# EasyEDA Pro project patched.epro, schematic Schematic1

## Sheets
1 sheet1_power_simplified: Board Name: Board1; Create Date: 2026-04-15; Page Name: sheet1_power_simplified; Project Name: Therapia_EEG-HRV; Schematic Name: Schematic1; Update Date: 2026-04-16; Company: EasyEDA.com; Page Size: A4; Version: V1.0
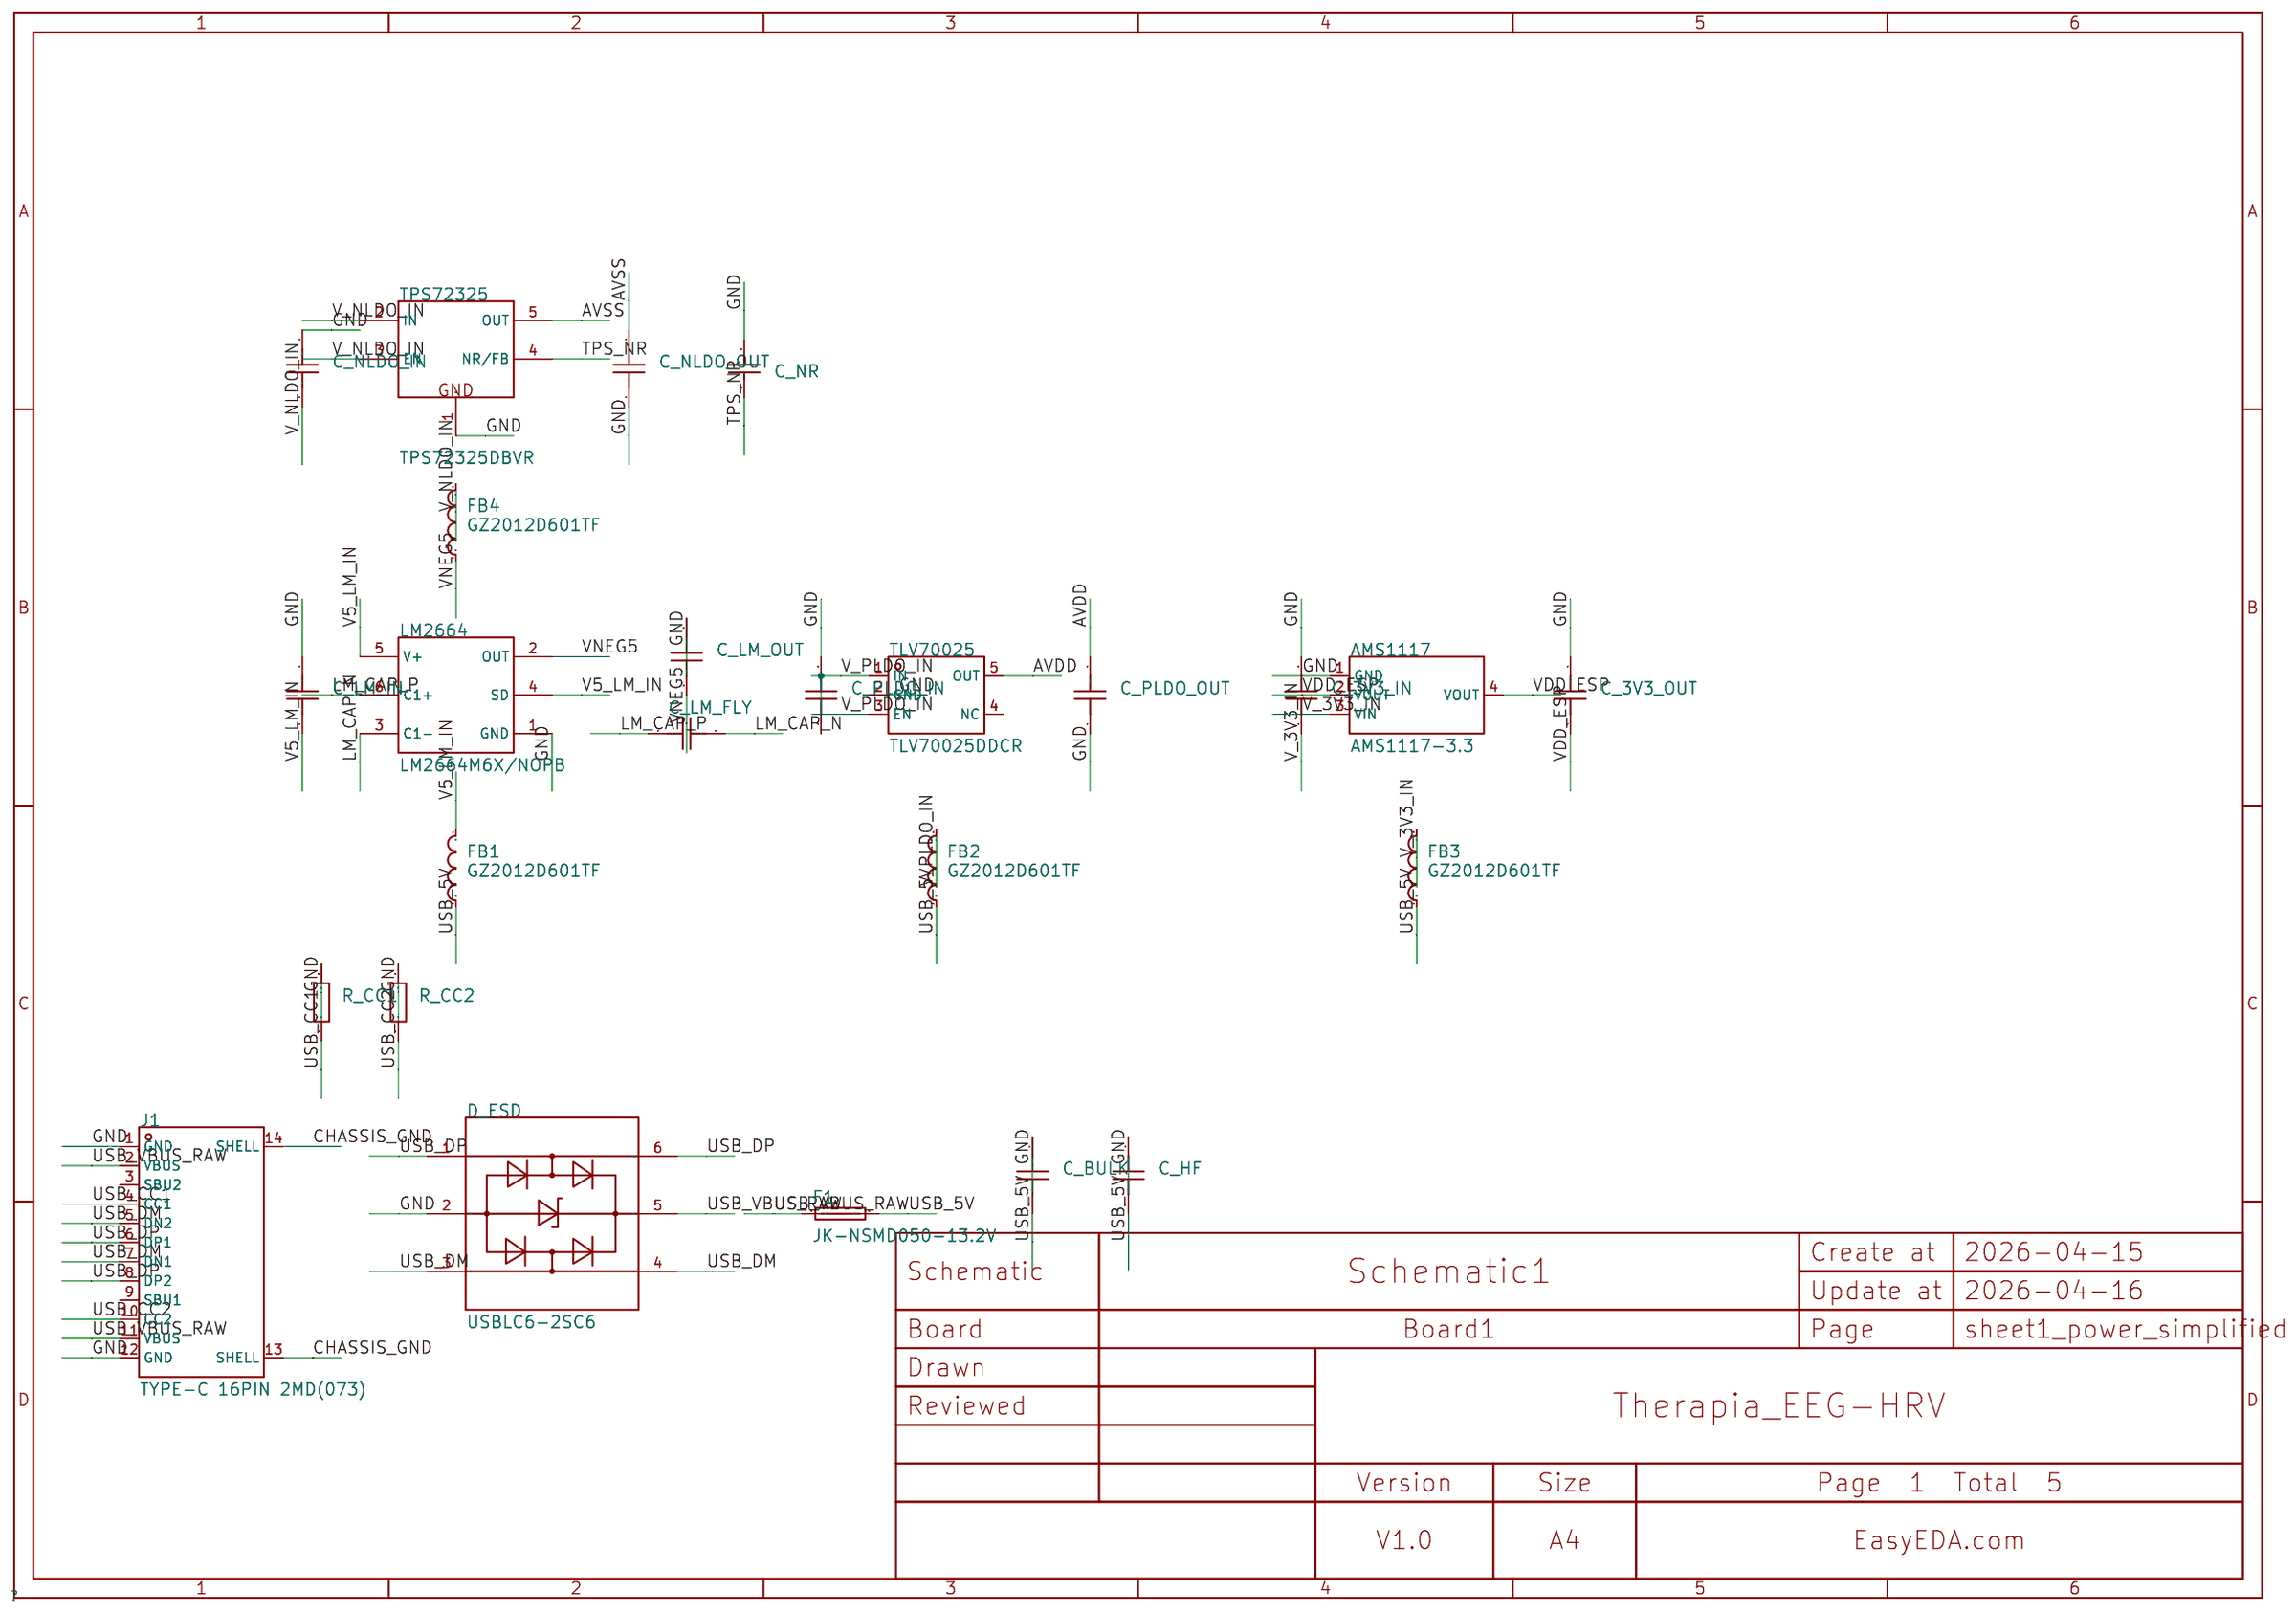
[diagram p0: sheet1_power_simplified]
2 sheet2_rails: Page Name: sheet2_rails
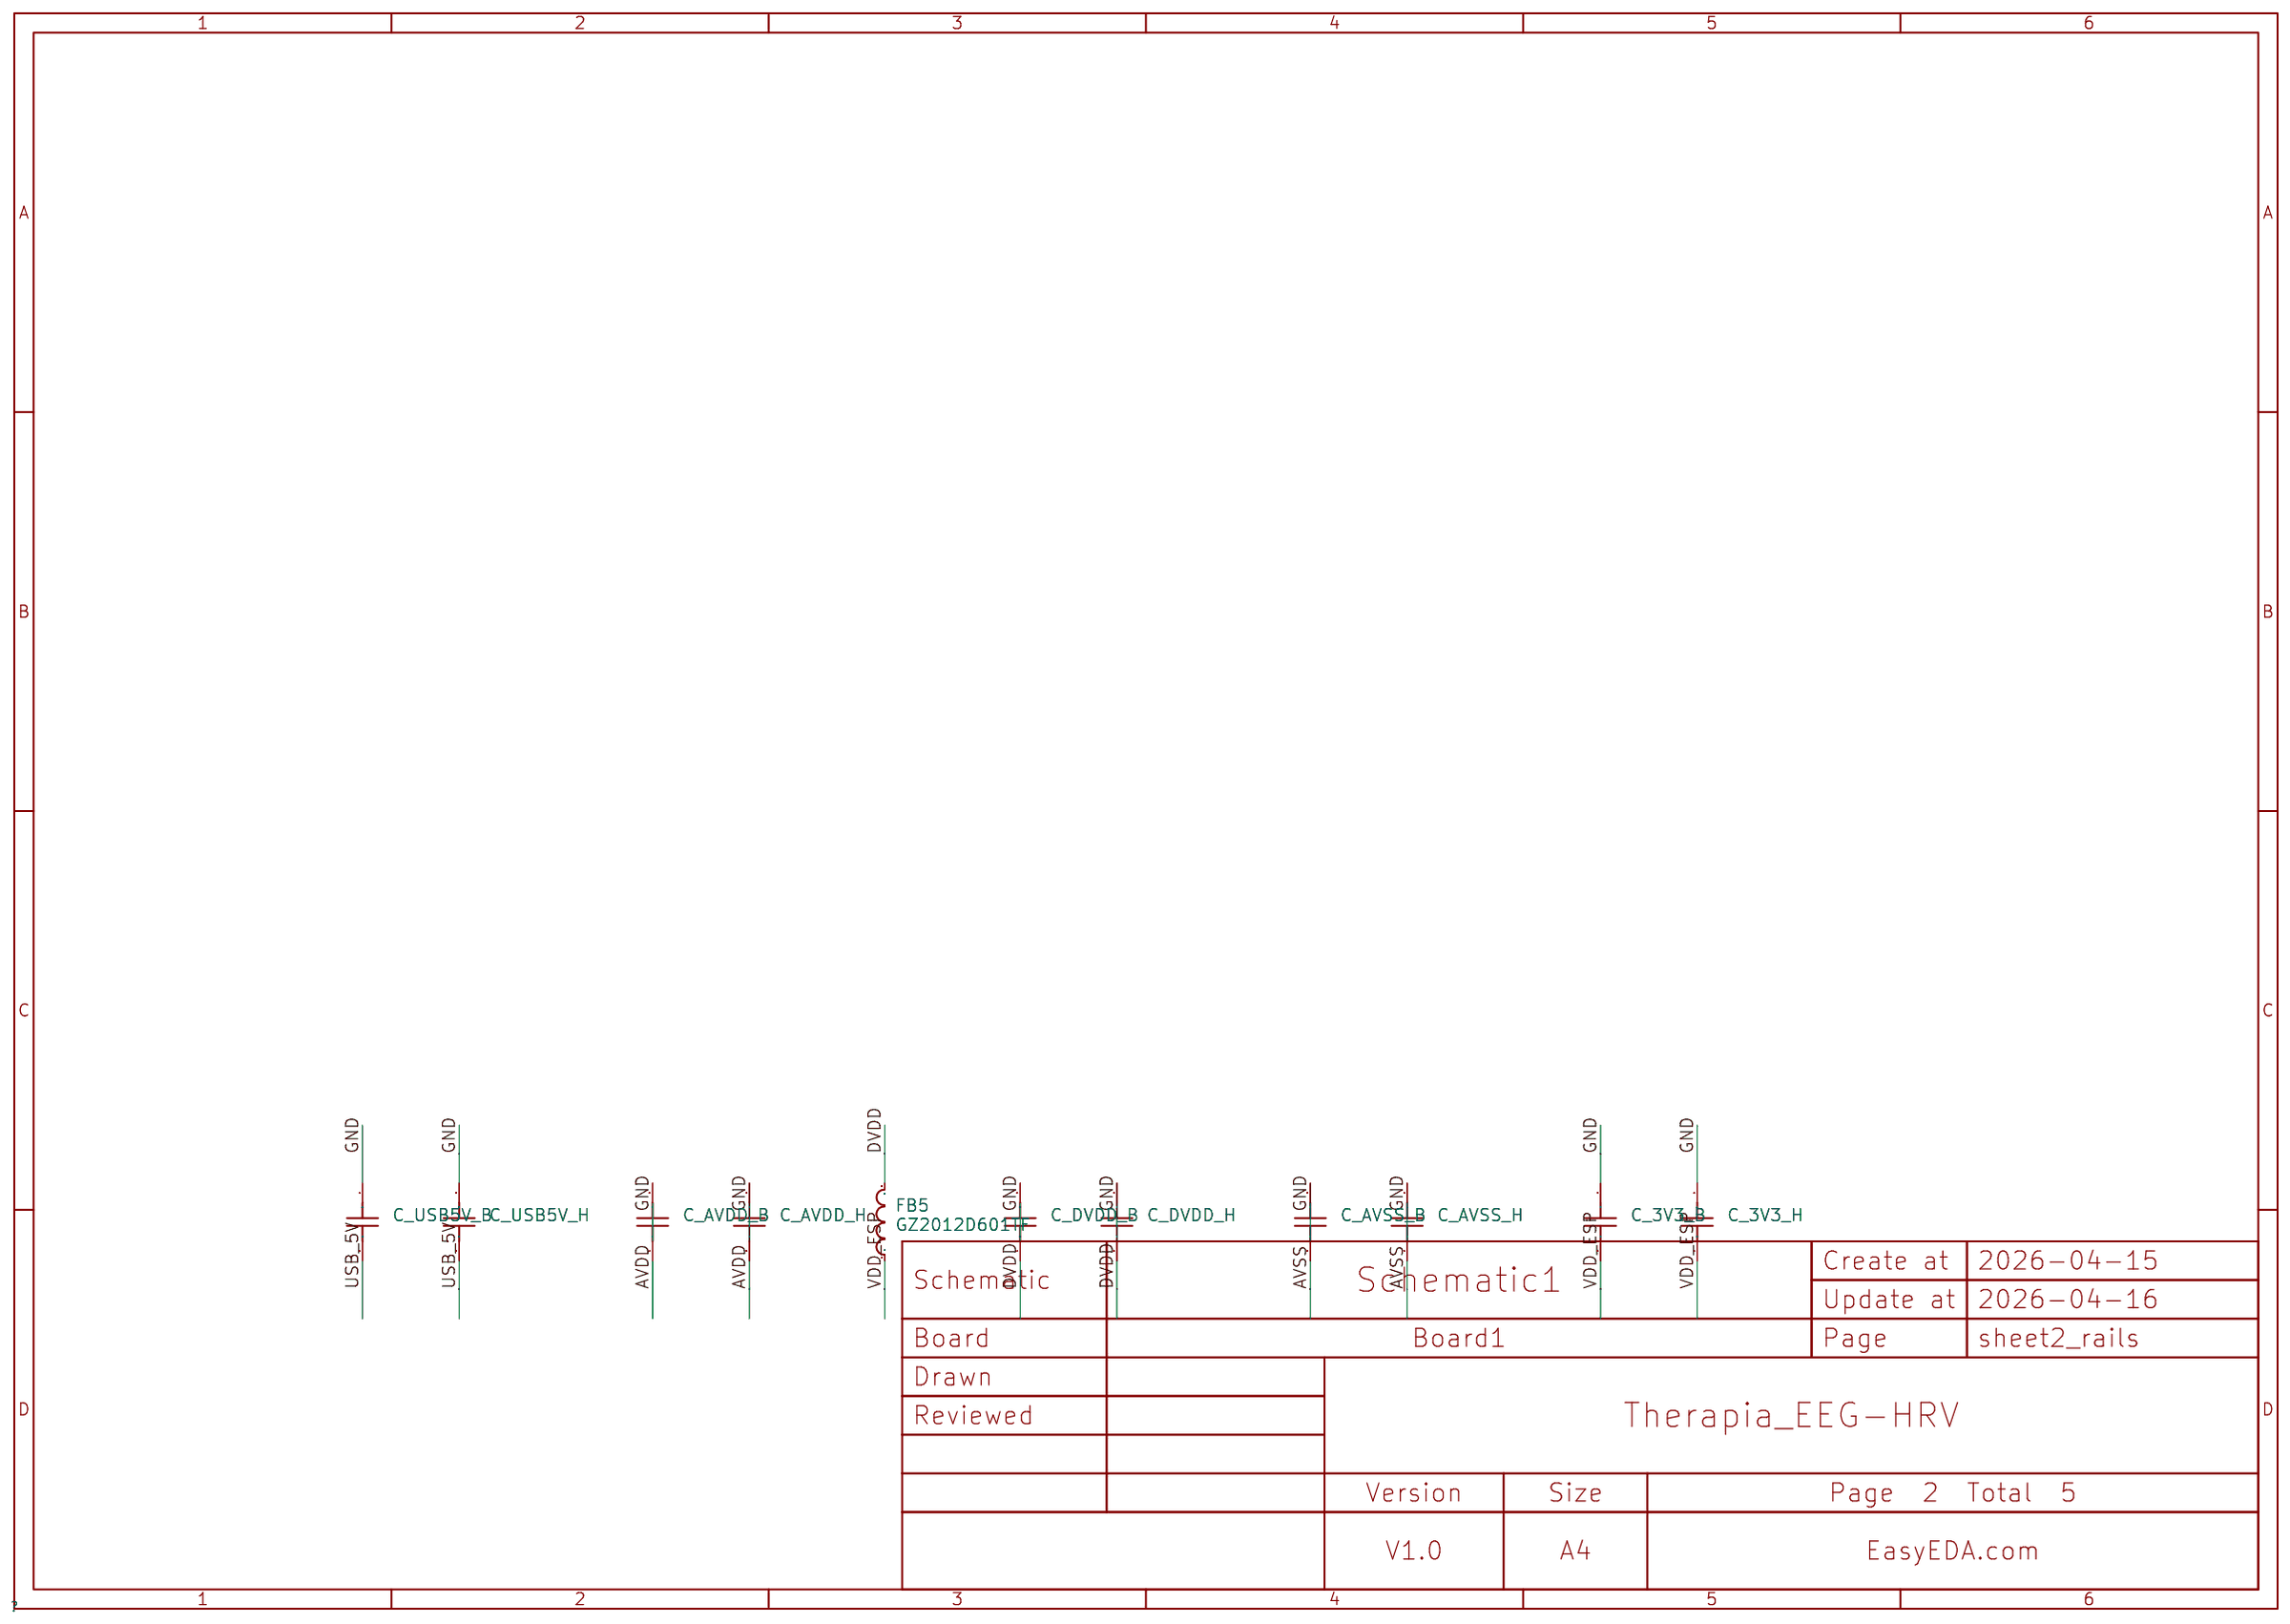
[diagram p1: sheet2_rails]
3 sheet3_mcu: Page Name: sheet3_mcu
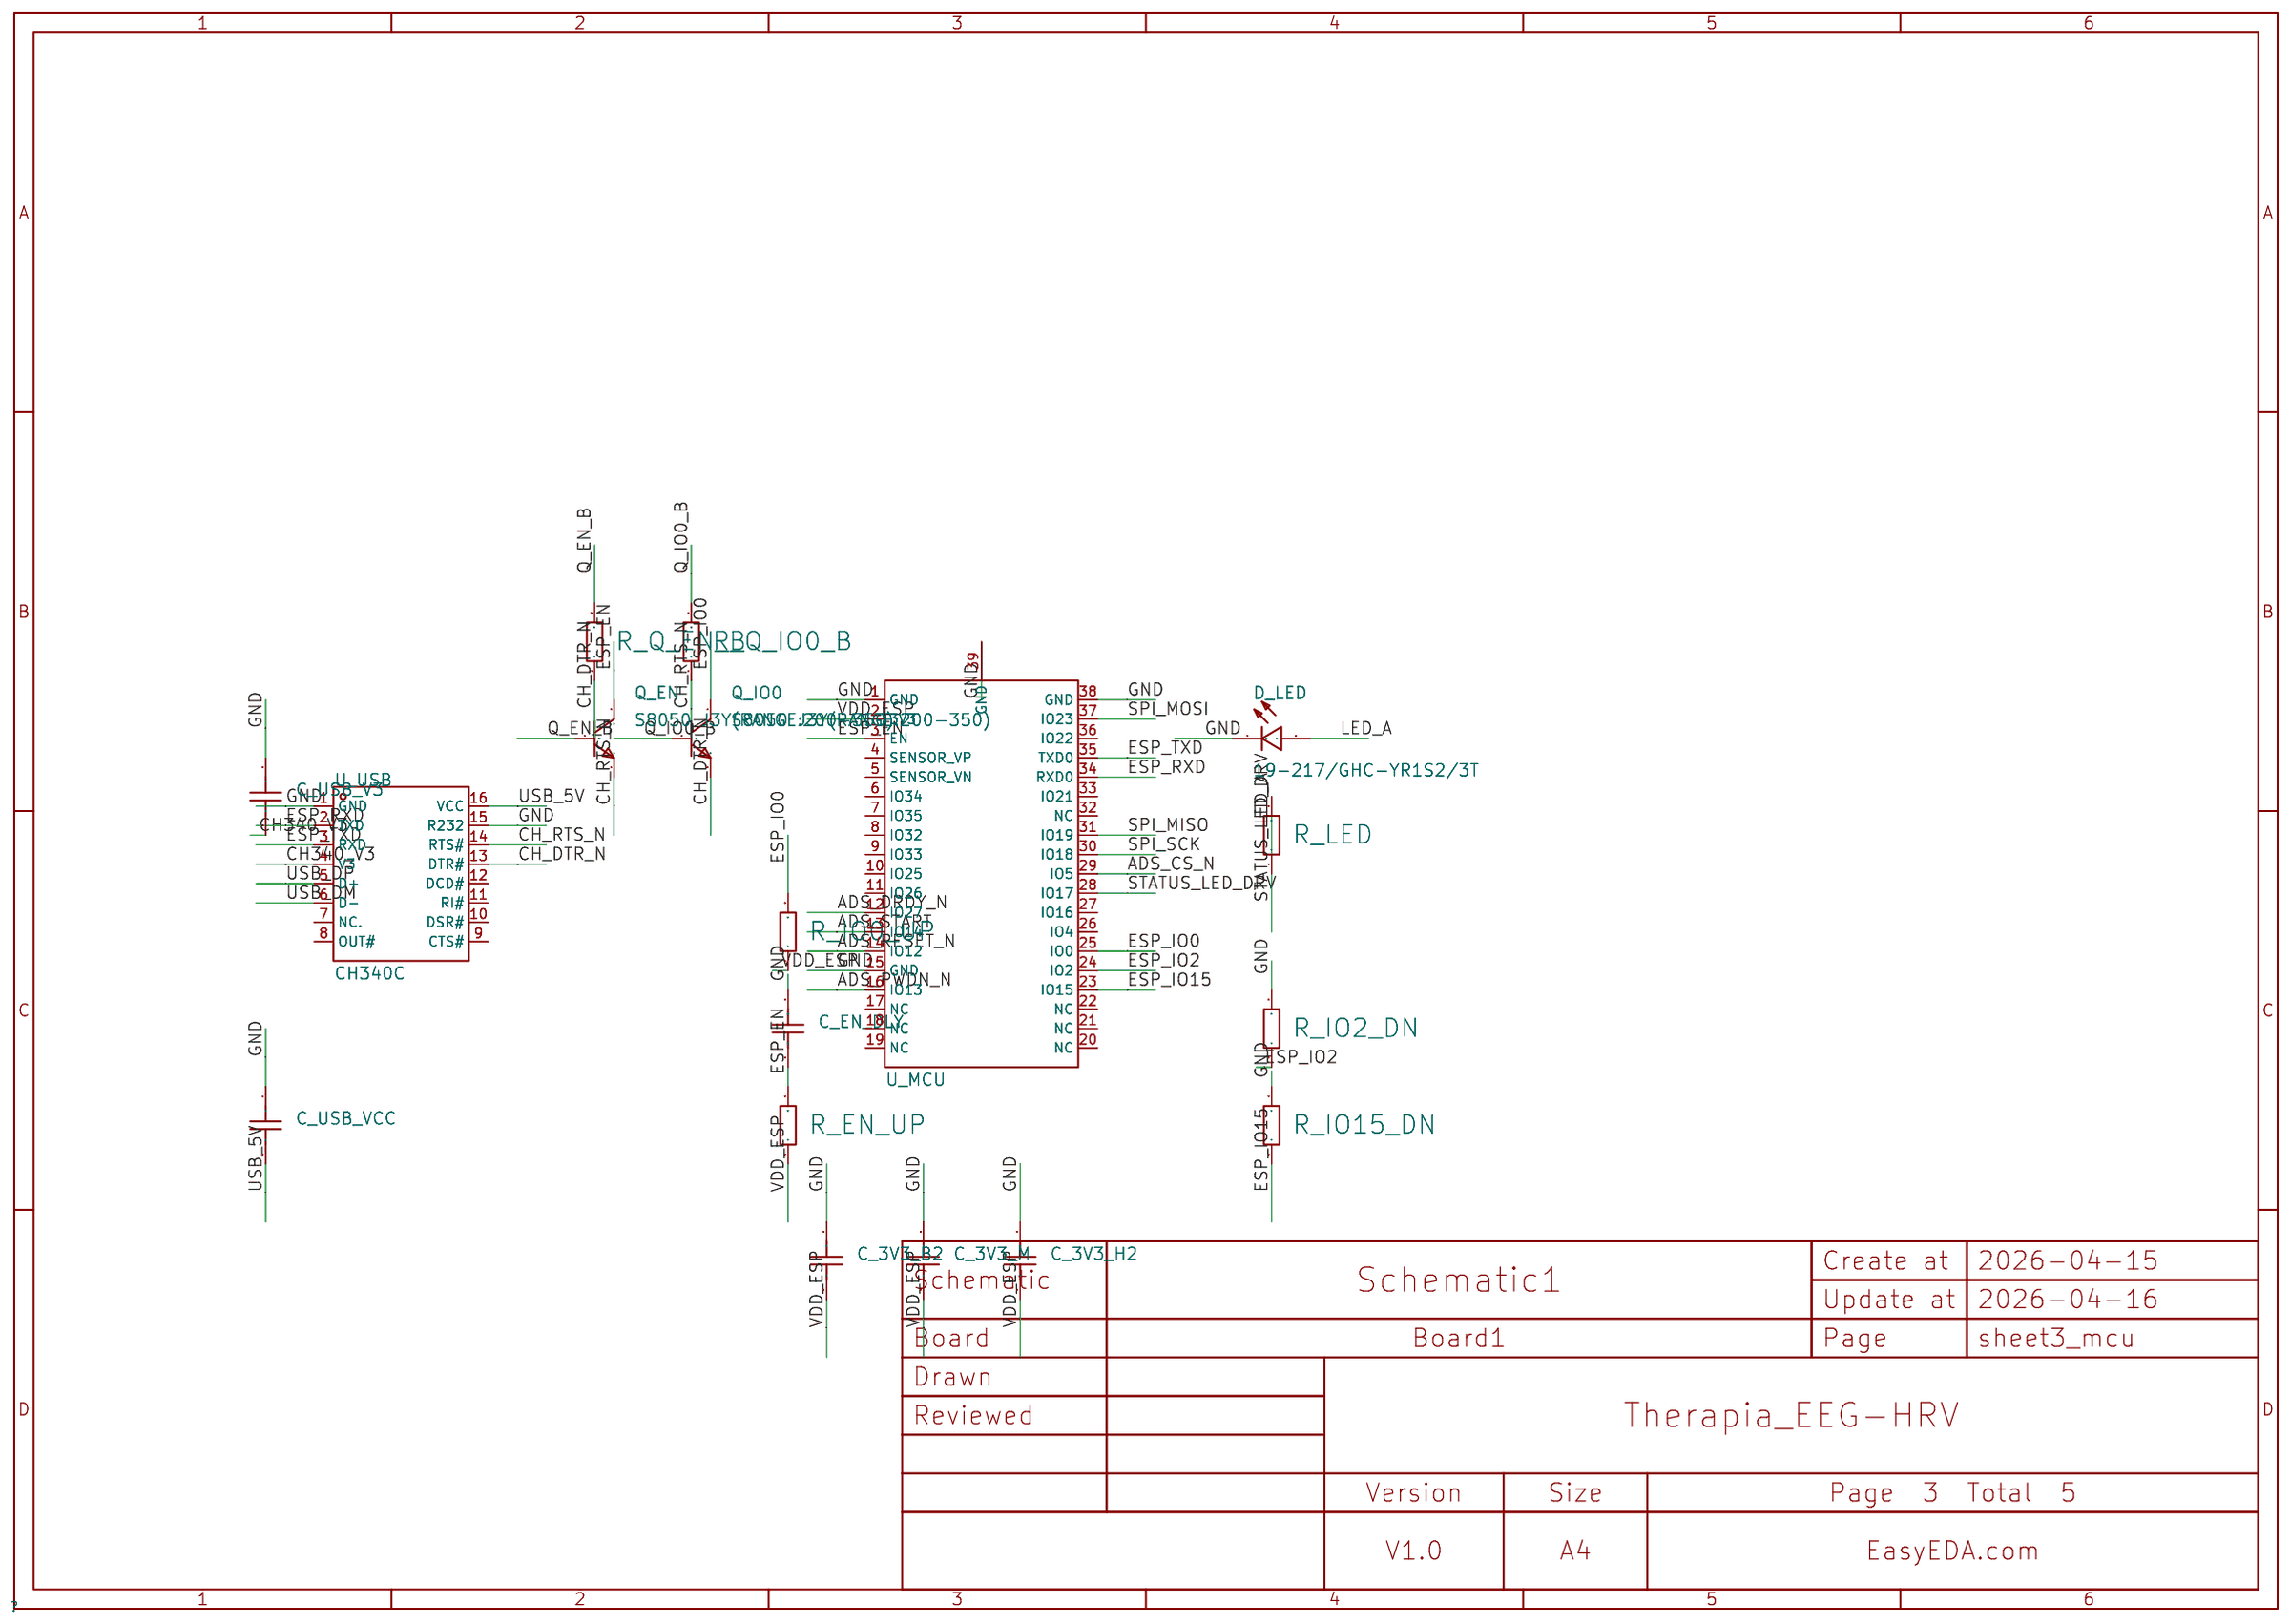
[diagram p2: sheet3_mcu]
4 sheet4_ads1299: Page Name: sheet4_ads1299
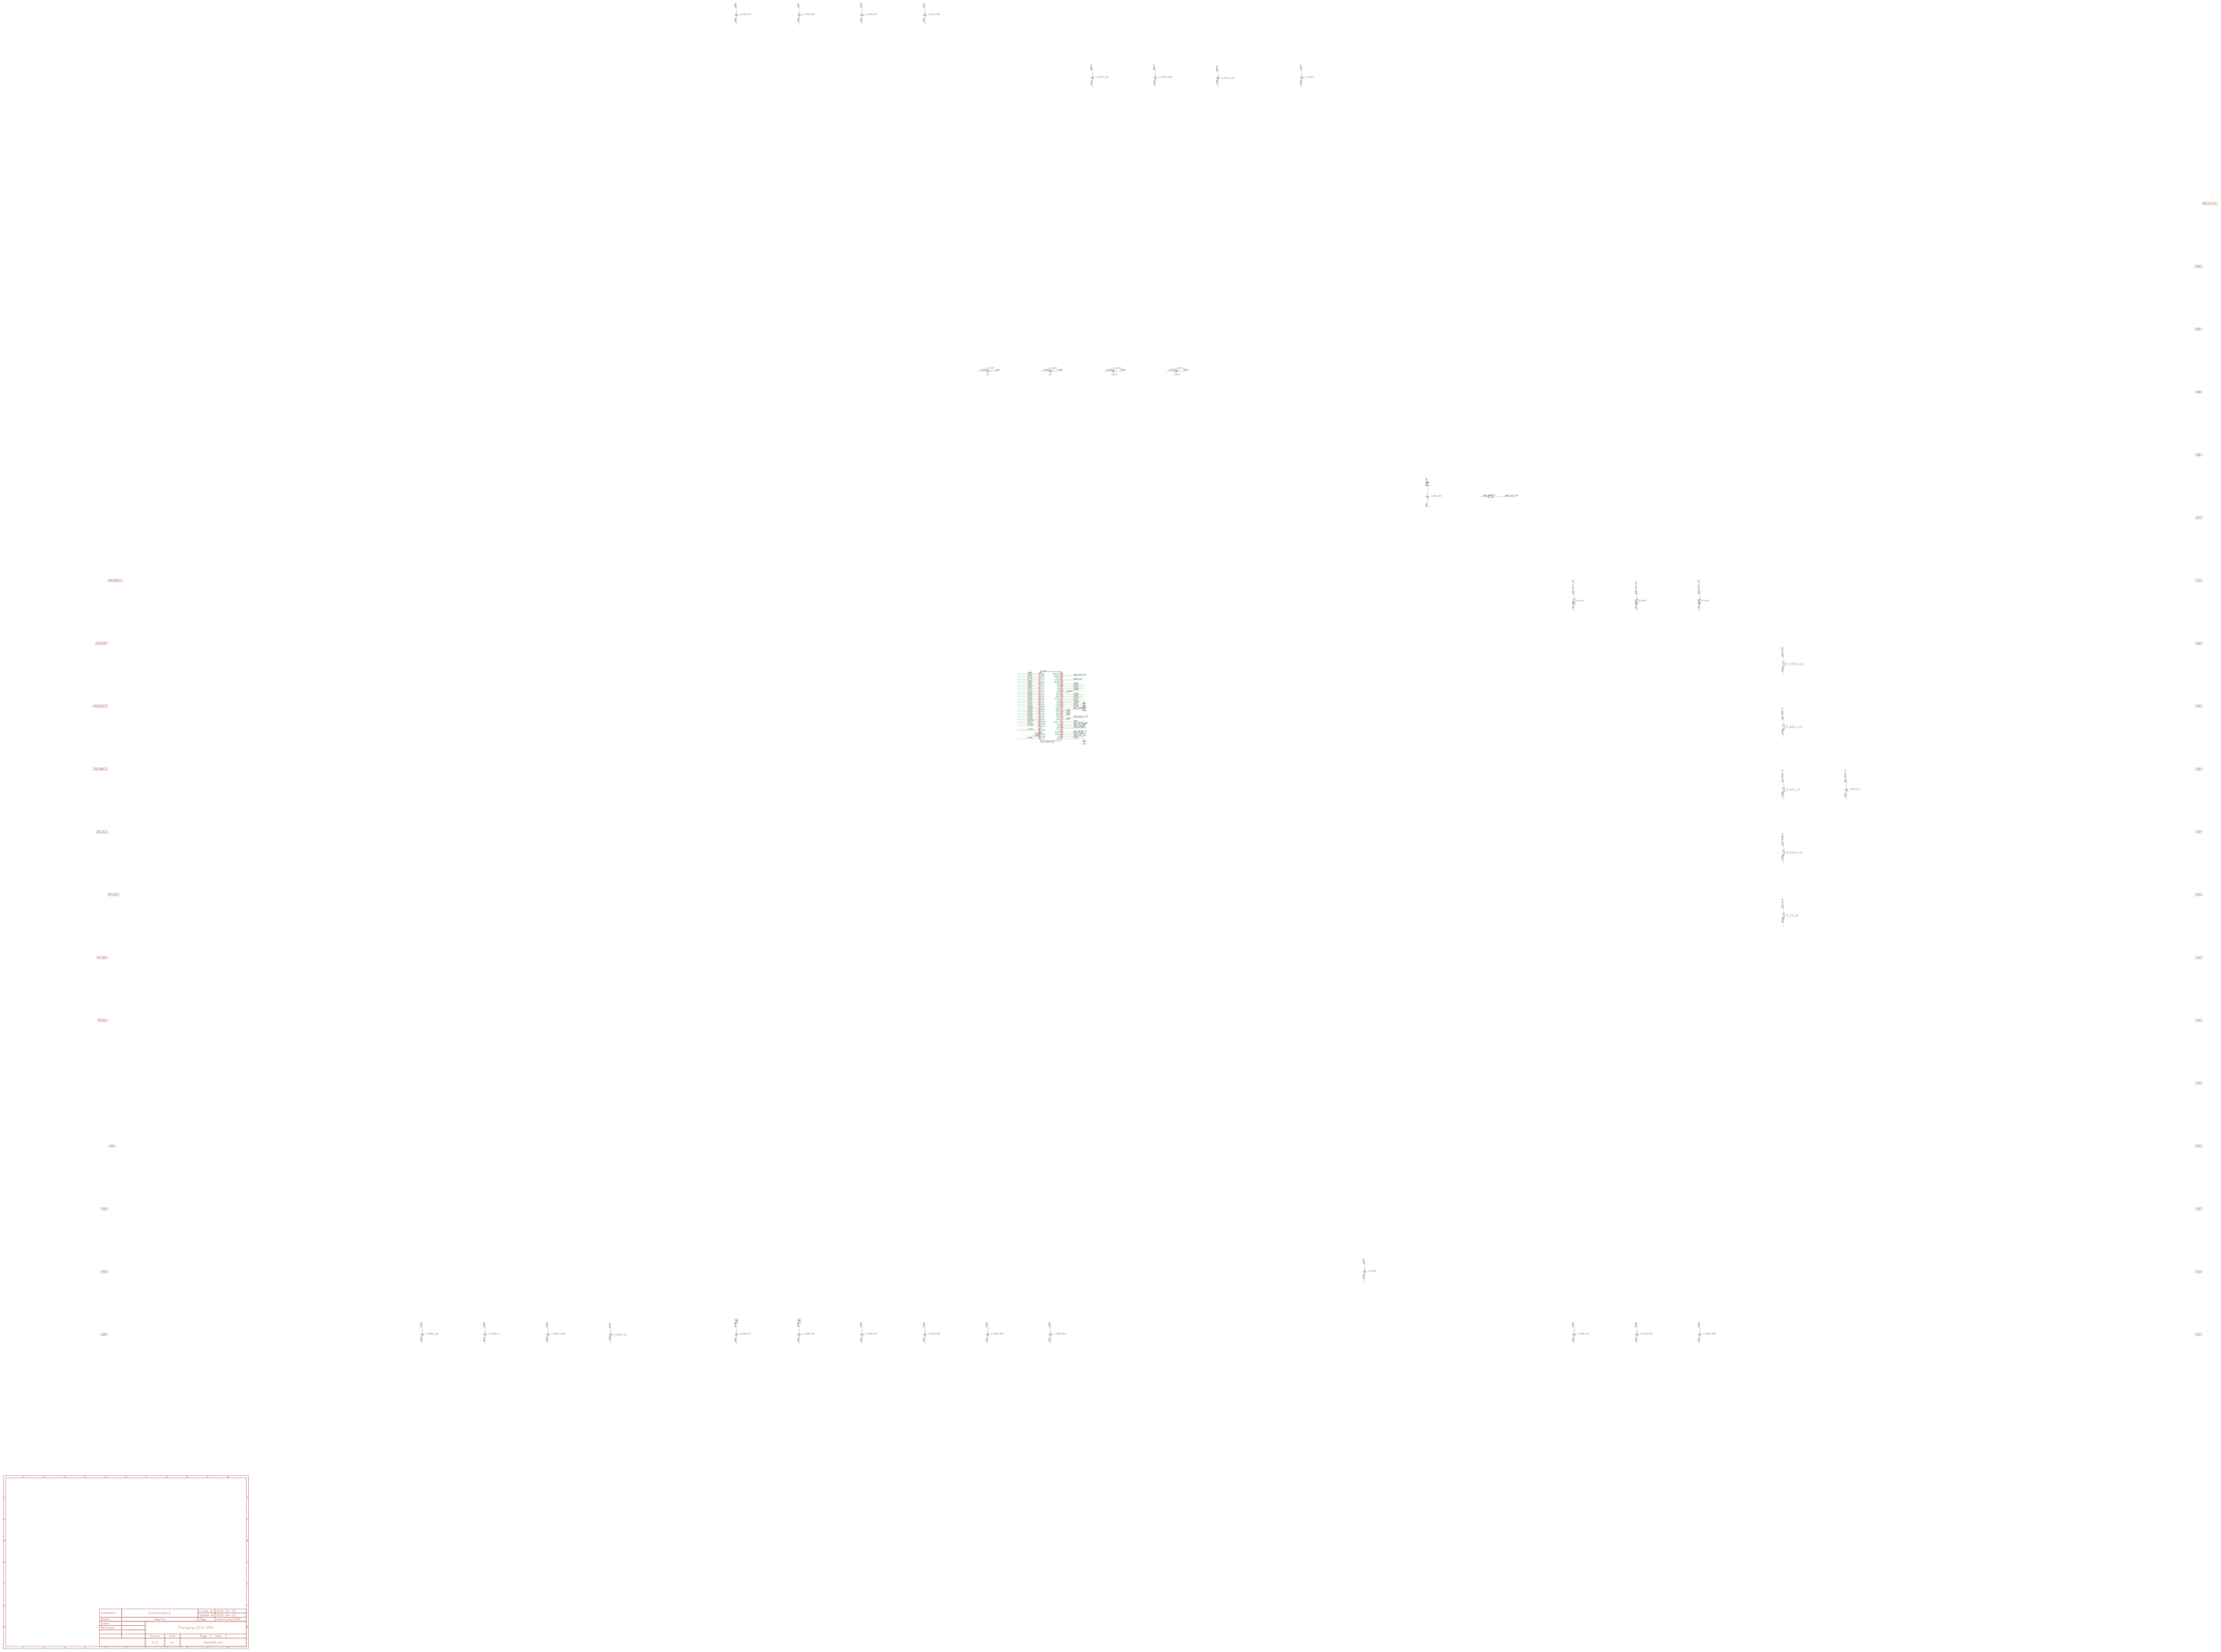
[diagram p3: sheet4_ads1299]
5 sheet5_frontend: Page Name: sheet5_frontend; Update Date: 2026-04-15
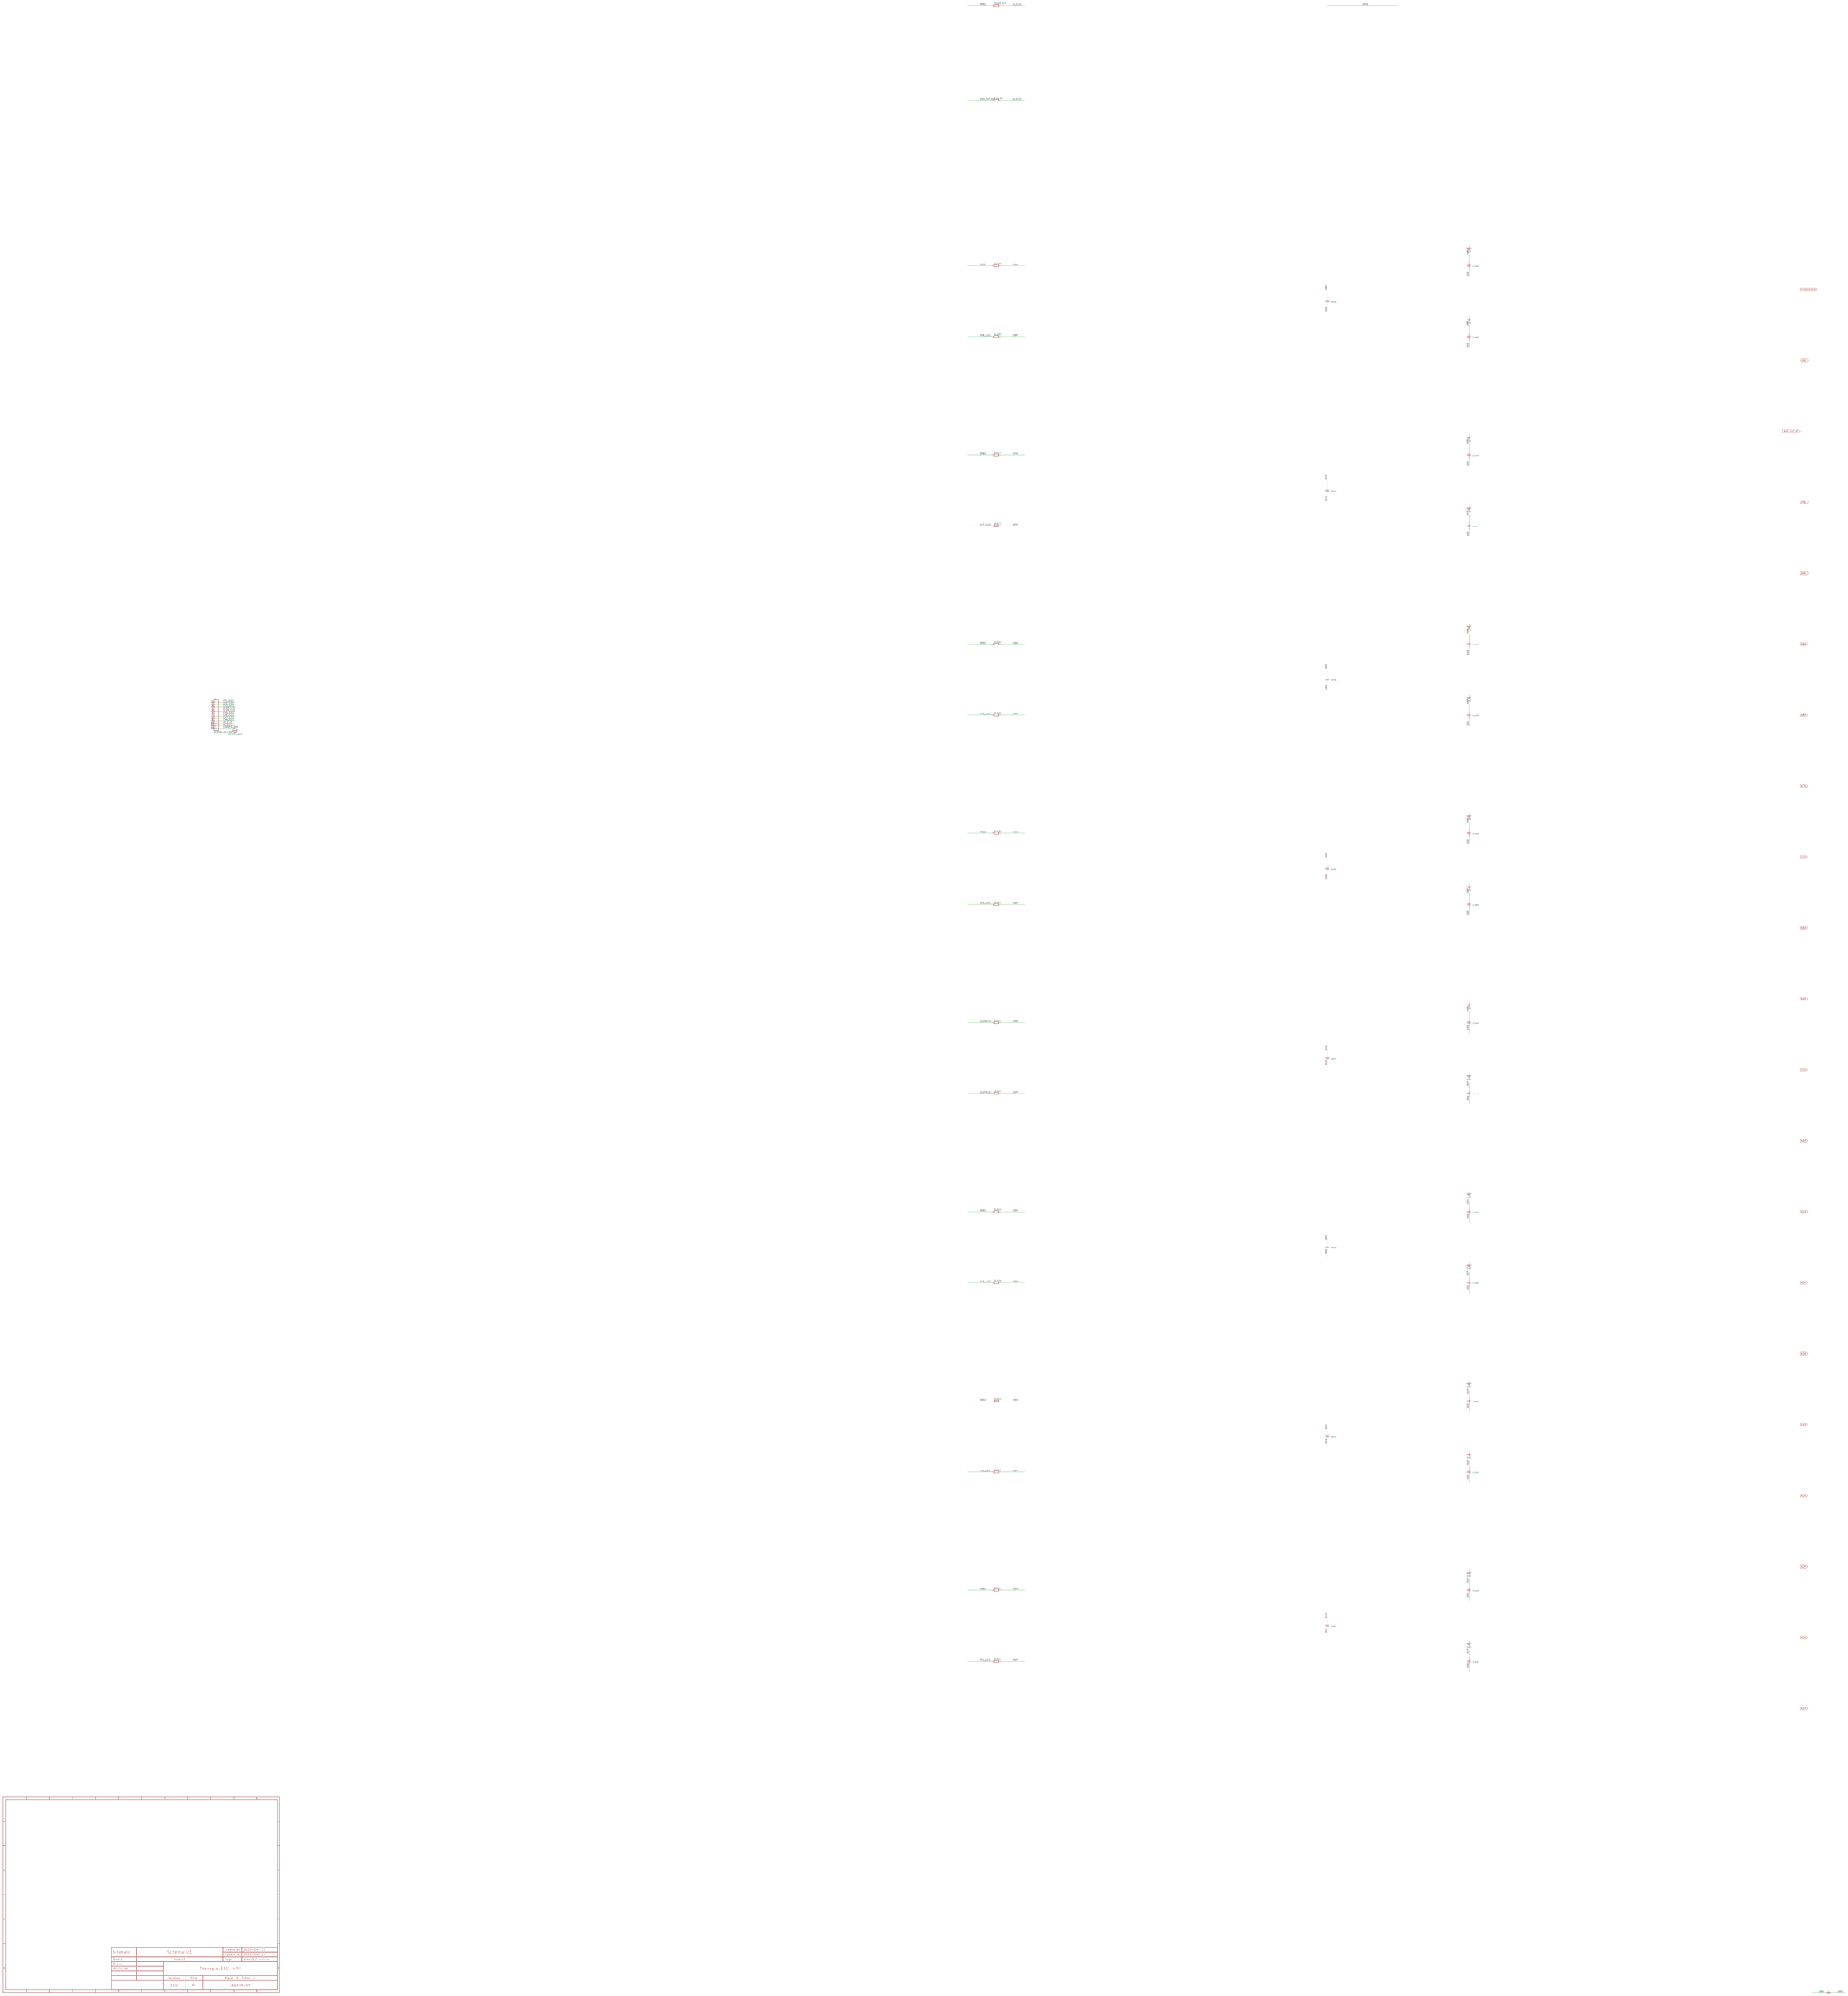
[diagram p4: sheet5_frontend]

## Parts
sheet sheet1_power_simplified
AMS1117  AMS1117-3.3  [SOT-223-3_L6.5-W3.4-P2.30-LS7.0-BR]
C_3V3_IN  1uF  [C0402]
C_3V3_OUT  1uF  [C0603]
C_BULK  1uF  [C0603]
C_HF  100nF  [C0402]
C_LM_FLY  1uF  [C0603]
C_LM_IN  1uF  [C0402]
C_LM_OUT  1uF  [C0603]
C_NLDO_IN  1uF  [C0402]
C_NLDO_OUT  1uF  [C0402]
C_NR  100pF  [C0402]
C_PLDO_IN  1uF  [C0402]
C_PLDO_OUT  1uF  [C0402]
D_ESD  USBLC6-2SC6  [SOT-23-6_L2.9-W1.6-P0.95-LS2.8-BL]
F1  JK-NSMD050-13.2V  [F1206]
FB1  GZ2012D601TF  [L0805]
FB2  GZ2012D601TF  [L0805]
FB3  GZ2012D601TF  [L0805]
FB4  GZ2012D601TF  [L0805]
J1  TYPE-C 16PIN 2MD(073)  [USB-C-SMD_TYPE-C-6PIN-2MD-073]
LM2664  LM2664M6X/NOPB  [SOT-23-6_L2.9-W1.6-P0.95-LS2.8-BR]
R_CC1  5.1kΩ  [R0603]
R_CC2  5.1kΩ  [R0603]
TLV70025  TLV70025DDCR  [SOT-23-5_L3.0-W1.7-P0.95-LS2.8-BR]
TPS72325  TPS72325DBVR  [SOT-23-5_L3.0-W1.7-P0.95-LS2.8-BR]
sheet sheet2_rails
C_3V3_B  1uF  [C0603]
C_3V3_H  100nF  [C0402]
C_AVDD_B  1uF  [C0603]
C_AVDD_H  100nF  [C0402]
C_AVSS_B  1uF  [C0603]
C_AVSS_H  100nF  [C0402]
C_DVDD_B  1uF  [C0603]
C_DVDD_H  100nF  [C0402]
C_USB5V_B  1uF  [C0603]
C_USB5V_H  100nF  [C0402]
FB5  GZ2012D601TF  [L0805]
sheet sheet3_mcu
C_3V3_B2  1uF  [C0603]
C_3V3_H2  100nF  [C0402]
C_3V3_M  1uF  [C0402]
C_EN_DLY  100nF  [C0402]
C_USB_V3  100nF  [C0402]
C_USB_VCC  100nF  [C0402]
D_LED  19-217/GHC-YR1S2/3T  [LED0603-RD]
Q_EN  S8050 J3Y(RANGE:200-350)  [SOT-23-3_L3.0-W1.7-P0.95-LS2.9-BR]
Q_IO0  S8050 J3Y(RANGE:200-350)  [SOT-23-3_L3.0-W1.7-P0.95-LS2.9-BR]
R_EN_UP  10kΩ  [R0603]
R_IO0_UP  10kΩ  [R0603]
R_IO2_DN  10kΩ  [R0603]
R_IO15_DN  10kΩ  [R0603]
R_LED  10kΩ  [R0603]
R_Q_EN_B  10kΩ  [R0603]
R_Q_IO0_B  10kΩ  [R0603]
U_MCU  2.4GHz  [WIFI-SMD_ESP32-WROOM-32E]
U_USB  CH340C  [SOP-16_L10.0-W3.9-P1.27-LS6.0-BL]
sheet sheet4_ads1299
C_AVDD1_1u  1uF  [C0402]
C_AVDD1_10n  100pF  [C0402]
C_AVDD1_10u  1uF  [C0603]
C_AVDD1_100n  100nF  [C0402]
C_AVDD_P3  100nF  [C0402]
C_AVDD_P19  100nF  [C0402]
C_AVDD_P31  100nF  [C0402]
C_AVDD_P36  100nF  [C0402]
C_AVDD_P59  100nF  [C0402]
C_AVDD_P64  100nF  [C0402]
C_AVSS_P17  100nF  [C0402]
C_AVSS_P30  100nF  [C0402]
C_AVSS_P37  100nF  [C0402]
C_AVSS_P60  100nF  [C0402]
C_BIAS_INV  100nF  [C0402]
C_DVDD_10u  1uF  [C0603]
C_DVDD_P40  100nF  [C0402]
C_DVDD_P58  100nF  [C0402]
C_RST_DLY  100nF  [C0402]
C_VCAP1  1uF  [C0603]
C_VCAP1_H  100nF  [C0402]
C_VCAP2  1uF  [C0402]
C_VCAP3  1uF  [C0402]
C_VCAP3_H  100nF  [C0402]
C_VCAP4  1uF  [C0402]
C_VREFP_10n  100pF  [C0402]
C_VREFP_10u  1uF  [C0603]
C_VREFP_100n  100nF  [C0402]
R_BIAS_FB  1MΩ  [R0805]
R_CS_UP  10kΩ  [R0603]
R_DRDY_UP  10kΩ  [R0603]
R_MISO  0Ω  [R0805]
R_MOSI  0Ω  [R0805]
R_PWDN_UP  10kΩ  [R0603]
R_RST_UP  10kΩ  [R0603]
R_SCLK  0Ω  [R0805]
R_START_DN  10kΩ  [R0603]
U_ADS  ADS1299IPAGR  [TQFP-64_L10.0-W10.0-P0.50-LS12.0-TL]
sheet sheet5_frontend
C_CM1N  1nF  [C0603]
C_CM1P  1nF  [C0603]
C_CM2N  1nF  [C0603]
C_CM2P  1nF  [C0603]
C_CM3N  1nF  [C0603]
C_CM3P  1nF  [C0603]
C_CM4N  1nF  [C0603]
C_CM4P  1nF  [C0603]
C_CM5N  1nF  [C0603]
C_CM5P  1nF  [C0603]
C_CM6N  1nF  [C0603]
C_CM6P  1nF  [C0603]
C_CM7N  1nF  [C0603]
C_CM7P  1nF  [C0603]
C_CM8N  1nF  [C0603]
C_CM8P  1nF  [C0603]
C_DIF1  100nF  [C0805]
C_DIF2  100nF  [C0805]
C_DIF3  100nF  [C0805]
C_DIF4  100nF  [C0805]
C_DIF5  100nF  [C0805]
C_DIF6  100nF  [C0805]
C_DIF7  100nF  [C0805]
C_DIF8  100nF  [C0805]
J2  PZ254V-11-12P  [HDR-TH_12P-P2.54-V-M]
R_BIAS_SER  1MΩ  [R0805]
R_IN1N  10kΩ  [R0402]
R_IN1P  10kΩ  [R0402]
R_IN2N  10kΩ  [R0402]
R_IN2P  10kΩ  [R0402]
R_IN3N  10kΩ  [R0402]
R_IN3P  10kΩ  [R0402]
R_IN4N  10kΩ  [R0402]
R_IN4P  10kΩ  [R0402]
R_IN5N  10kΩ  [R0402]
R_IN5P  10kΩ  [R0402]
R_IN6N  10kΩ  [R0402]
R_IN6P  10kΩ  [R0402]
R_IN7N  10kΩ  [R0402]
R_IN7P  10kΩ  [R0402]
R_IN8N  10kΩ  [R0402]
R_IN8P  10kΩ  [R0402]
R_SRB_SER  0Ω  [R0805]

## Library data of the parts
AMS1117 = AMS1117-3.3_C6186: Output Type:Fixed Voltage - Supply:15V Output Voltage:3.3V Output Voltage:3.3V Output Current:1A Power Supply Rejection Ratio (PSRR):72dB@(120Hz) Voltage Dropout:1.1V@(800mA) standby current:5mA Noise:0.003%Vout Features:Over Current Protection；Thermal Sh; LCSC Part Name: 3.3V 1A 15V; Supplier Part: AMS1117-3.3.1; Manufacturer: AMS; Supplier Footprint: SOT-223; JLCPCB Part Class: Basic Part; Datasheet: https://item.szlcsc.com/datasheet/AMS1117-3.3/6652.html; Supplier: LCSC; Output Type: Fixed; Voltage - Supply: 15V; Output Voltage: 3.3V; Output Current: 1A; Power Supply Rejection Ratio (PSRR): 72dB@(120Hz); Voltage Dropout: 1.1V@(800mA); standby current: 5mA; Noise: 0.003%Vout; Features: Over Current Protection；Thermal Shutdown; Operating Temperature: -40℃~+125℃; Output Configuration: Positive; Number of Outputs: 1
C_3V3_IN C_3V3_M C_AVDD1_1u C_LM_IN C_NLDO_IN C_NLDO_OUT C_PLDO_IN C_PLDO_OUT C_VCAP4 = CL05A105KA5NQNC: Capacitance:1uF Tolerance:±10% Tolerance:±10% Voltage Rating:25V Temperature Coefficient:X5R; LCSC Part Name: 1uF ±10% 25V; Supplier Part: CL05A105KA5NQNC.1; Manufacturer: SAMSUNG(三星); Supplier Footprint: 0402; JLCPCB Part Class: Basic Part; Datasheet: https://item.szlcsc.com/datasheet/CL05A105KA5NQNC/53938.html; Supplier: LCSC; Tolerance: ±10%; Voltage Rating: 25V; Temperature Coefficient: X5R
C_3V3_B C_3V3_B2 C_3V3_OUT C_AVDD1_10u C_AVDD_B C_AVSS_B C_BULK C_DVDD_10u C_DVDD_B C_LM_FLY C_LM_OUT C_USB5V_B C_VCAP1 C_VREFP_10u = CL10A105KB8NNNC: Capacitance:1uF Tolerance:±10% Tolerance:±10% Voltage Rating:50V Temperature Coefficient:X5R; LCSC Part Name: 1uF ±10% 50V; Supplier Part: CL10A105KB8NNNC.1; Manufacturer: SAMSUNG(三星); Supplier Footprint: 0603; JLCPCB Part Class: Basic Part; Datasheet: https://item.szlcsc.com/datasheet/CL10A105KB8NNNC/16531.html; Supplier: LCSC; Tolerance: ±10%; Voltage Rating: 50V; Temperature Coefficient: X5R
C_3V3_H C_3V3_H2 C_AVDD1_100n C_AVDD_H C_AVDD_P3 C_AVDD_P19 C_AVDD_P31 C_AVDD_P36 C_AVDD_P59 C_AVDD_P64 C_AVSS_H C_AVSS_P17 C_AVSS_P30 C_AVSS_P37 C_AVSS_P60 C_BIAS_INV C_DVDD_H C_DVDD_P40 C_DVDD_P58 C_EN_DLY C_HF C_RST_DLY C_USB5V_H C_USB_V3 C_USB_VCC C_VREFP_100n = CL05B104KO5NNNC: Capacitance:100nF Tolerance:±10% Tolerance:±10% Voltage Rating:16V Temperature Coefficient:X7R; LCSC Part Name: 100nF ±10% 16V; Supplier Part: CL05B104KO5NNNC.1; Manufacturer: SAMSUNG(三星); Supplier Footprint: 0402; JLCPCB Part Class: Basic Part; Datasheet: https://item.szlcsc.com/datasheet/CL05B104KO5NNNC/1877.html; Supplier: LCSC; Tolerance: ±10%; Voltage Rating: 16V; Temperature Coefficient: X7R
C_AVDD1_10n C_NR C_VREFP_10n = 0402CG101J500NT: Capacitance:100pF Tolerance:±5% Tolerance:±5% Voltage Rating:50V Temperature Coefficient:C0G; LCSC Part Name: 100pF ±5% 50V; Supplier Part: 0402CG101J500NT.1; Manufacturer: FH(风华); Supplier Footprint: 0402; JLCPCB Part Class: Basic Part; Datasheet: https://item.szlcsc.com/datasheet/0402CG101J500NT/1898.html; Supplier: LCSC; Tolerance: ±5%; Voltage Rating: 50V; Temperature Coefficient: C0G
D_ESD = USBLC6-2SC6_C7519: Polarity:Unidirectional Reverse Stand-Off Voltage (Vrwm):5.25V Clamping Voltage:17V Peak Pulse Current (Ipp):5A Voltage - Breakdown:6V Reverse Leakage Current (Ir):150nA Number of Channels:2 Operating Temperature:-40℃~+125℃ Operating Temperature:-40℃~+125; LCSC Part Name: 单向ESD; Supplier Part: USBLC6-2SC6.1; Manufacturer: ST(意法半导体); Supplier Footprint: SOT-23-6L; JLCPCB Part Class: Extended Part; Datasheet: https://item.szlcsc.com/datasheet/USBLC6-2SC6/7996.html; Supplier: LCSC; Polarity: Unidirectional; Reverse Stand-Off Voltage (Vrwm): 5.25V; Clamping Voltage: 17V; Peak Pulse Current (Ipp): 5A; Voltage - Breakdown: 6V; Reverse Leakage Current (Ir): 150nA; Number of Channels: 2; Operating Temperature: -40℃~+125℃; level of protection: IEC 61000-4-2; Type: ESD; Junction Capacitance: 3.5pF
F1 = JK-NSMD050-13.2V: Voltage - Max:13.2V Current - Max:100A Hold Current:500mA Trip Current:1A Resistance - Initial (Ri) (Min):150mΩ Resistance - Post Trip (R1) (Max):700mΩ Time to Trip(Max):100ms Operating Temperature:-40℃~+85℃ Operating Temperature:-40℃~+85℃ Length:3.5mm Wi; LCSC Part Name: 贴片保险丝 1206 0.5A 13.2V  自恢复保险丝; Supplier Part: JK-NSMD050-13.2V.1; Manufacturer: JK(金科); Supplier Footprint: 1206; JLCPCB Part Class: Extended Part; Datasheet: https://item.szlcsc.com/datasheet/JK-NSMD050-13.2V/343072.html; Supplier: LCSC; Voltage - Max: 13.2V; Current - Max: 100A; Hold Current: 500mA; Trip Current: 1A; Resistance - Initial (Ri) (Min): 150mΩ; Resistance - Post Trip (R1) (Max): 700mΩ; Time to Trip(Max): 100ms; Operating Temperature: -40℃~+85℃; Length: 3.5mm; Width: 1.8mm; Height: 0.85mm
FB1-FB5 = GZ2012D601TF: Impedance @ Frequency:600Ω@100MHz Tolerance:±25% Tolerance:±25% DC Resistance(DCR):300mΩ Current Rating:500mA Number of Circuits:1; LCSC Part Name: 单路 0805磁珠 阻抗600Ω@100MHz; Supplier Part: GZ2012D601TF.1; Manufacturer: Sunlord(顺络); Supplier Footprint: 0805; JLCPCB Part Class: Basic Part; Datasheet: https://atta.szlcsc.com/upload/public/pdf/source/20241120/893429B990C3BA07384E734821D2F218.pdf; Supplier: LCSC; Impedance @ Frequency: 600Ω@100MHz; Tolerance: ±25%; DC Resistance(DCR): 300mΩ; Current Rating: 500mA; Number of Circuits: 1
J1 = TYPE-C 16PIN 2MD(073): Connector Type:Type-C Protocol Standard:- Gender:Female Mounting Type:Surface Mount, Right Angle Number of Contacts:16P Number of Ports:1 Current Rating-Power:3A Voltage Rating:5V Connect-Disconnect Life:10,000 Cycles Supplementary Features:- Center Heigh; LCSC Part Name: Type-C 母 卧贴; Supplier Part: TYPE-C 16PIN 2MD(073).1; Manufacturer: SHOU HAN(首韩); Supplier Footprint: SMD; JLCPCB Part Class: Extended Part; Datasheet: https://item.szlcsc.com/datasheet/TYPE-C%252016PIN%25202MD(073)/2901843.html; Supplier: LCSC; Connector Type: Type-C; Gender: Female; Mounting Type: Surface Mount, Right Angle; Number of Contacts: 16P; Number of Ports: 1; Current Rating-Power: 3A; Voltage Rating: 5V; Connect-Disconnect Life: 10,000 Cycles; Detection color: Black; Operating Temperature: -25℃~+85℃
LM2664 = LM2664M6X/NOPB: Operating Voltage:1.8V~5.5V Operating Voltage:1.8V~5.5V Quiescent Current:220uA Output Resistance:12Ω Energy Efficiency:91% Switching Frequency:80kHz Operating Temperature:-40℃~+85℃ Operating Temperature:-40℃~+85℃ Function:Inverted Output Voltage:-5.5V~-1; LCSC Part Name: 电荷泵电压转换器; Supplier Part: LM2664M6X/NOPB.1; Manufacturer: TI(德州仪器); Supplier Footprint: SOT-23-6; JLCPCB Part Class: Extended Part; Datasheet: https://www.ti.com/cn/lit/gpn/lm2664; Supplier: LCSC; Operating Voltage: 1.8V~5.5V; Quiescent Current: 220uA; Output Resistance: 12Ω; Energy Efficiency: 91%; Switching Frequency: 80kHz; Operating Temperature: -40℃~+85℃; Function: Inverted; Output Voltage: -5.5V~-1.8V; PFM Mode: Not Supported; Output Current: 40mA
R_CC1 R_CC2 = 0603WAF5101T5E: Type:Thick Film Resistor Resistance:5.1kΩ Tolerance:±1% Tolerance:±1% Power(Watts):100mW Voltage-Supply(Max):75V Temperature Coefficient:±100ppm/℃ Temperature Coefficient:±100ppm/℃ Operating Temperature:-55℃~+155℃ Operating Temperature:-55℃~+155℃; LCSC Part Name: 5.1kΩ ±1% 100mW 厚膜电阻; Supplier Part: 0603WAF5101T5E.1; Manufacturer: UNI-ROYAL(厚声); Supplier Footprint: 0603; JLCPCB Part Class: Basic Part; Datasheet: https://item.szlcsc.com/datasheet/0603WAF5101T5E/23913.html; Supplier: LCSC; Type: Thick Film Resistor; Tolerance: ±1%; Power(Watts): 100mW; Voltage-Supply(Max): 75V; Temperature Coefficient: ±100ppm/℃; Operating Temperature: -55℃~+155℃
TLV70025 = TLV70025DDCR: Output Type:Fixed Maximum Input Voltage:5.5V Output Voltage:2.5V Output Voltage:2.5V Output Current:200mA Power Supply Rejection Ratio (PSRR):68dB@(1kHz) Dropout Voltage:250mV@(200mA) standby current:55uA Feature:ESD Protection；Low ESR；Thermal Protection(; LCSC Part Name: 具有使能功能的 200mA、高 PSRR、低 IQ、低压降稳压器; Supplier Part: TLV70025DDCR.1; Manufacturer: TI(德州仪器); Supplier Footprint: SOT-23-5; JLCPCB Part Class: Extended Part; Datasheet: https://www.ti.com/cn/lit/gpn/tlv700; Supplier: LCSC; Output Type: Fixed; Maximum Input Voltage: 5.5V; Output Voltage: 2.5V; Output Current: 200mA; Power Supply Rejection Ratio (PSRR): 68dB@(1kHz); Dropout Voltage: 250mV@(200mA); standby current: 55uA; Feature: ESD Protection；Low ESR；Thermal Protection(TSD)；Under-voltage Lockout；Overcurrent Protection(OCP)；With ability; Operating Temperature: -40℃~+125℃@(Tj); Output Polarity: Positive electrode; Number of Outputs: 1
TPS72325 = TPS72325DBVR: Output Type:Fixed Maximum Input Voltage:10V Output Voltage:2.5V Output Voltage:2.5V Output Current:200mA Power Supply Rejection Ratio (PSRR):65dB Dropout Voltage:500mV@(200mA) standby current:200uA Feature:防静电保护；低ESR；Thermal Protection(TSD)；Overcurrent Pr; LCSC Part Name: 输入10V 输出2.5V 200mA; Supplier Part: TPS72325DBVR.1; Manufacturer: TI(德州仪器); Supplier Footprint: SOT-23-5; JLCPCB Part Class: Extended Part; Datasheet: https://www.ti.com/cn/lit/gpn/tps723; Supplier: LCSC; Output Type: Fixed; Maximum Input Voltage: 10V; Output Voltage: 2.5V; Output Current: 200mA; Power Supply Rejection Ratio (PSRR): 65dB; Dropout Voltage: 500mV@(200mA); standby current: 200uA; Feature: 防静电保护；低ESR；Thermal Protection(TSD)；Overcurrent Protection(OCP)；带使能；防倒灌; Operating Temperature: -40℃~+125℃; Output Polarity: Negative electrode; Number of Outputs: 1
D_LED = 19-217/GHC-YR1S2/3T: Lamp Holder Type:- Illumination Color:Emerald Green Voltage - Forward(Vf):3.3V Voltage - Forward(Vf):3.3V Power(Watts):110mW Forward Current:20mA Wavelength - Dominant:520nm~535nm Wavelength - Dominant:520nm~535nm Peak Wavelength:518nm Diode Configuration; LCSC Part Name: 翠绿 停产; Supplier Part: 19-217/GHC-YR1S2/3T.1; Manufacturer: EVERLIGHT(亿光); Supplier Footprint: 0603; JLCPCB Part Class: Extended Part; Supplier: LCSC; Illumination Color: Emerald Green; Voltage - Forward(Vf): 3.3V; Power(Watts): 110mW; Forward Current: 20mA; Wavelength - Dominant: 520nm~535nm; Peak Wavelength: 518nm; Diode Configuration: Discrete Diode; Lens Color: Water Clear; Luminous Intensity: 199mcd; Viewing Angle: 120°; Operating Temperature: -40℃~+85℃
Q_EN Q_IO0 = S8050 J3Y(RANGE:200-350): type:NPN Current - Collector(Ic):500mA Collector - Emitter Voltage VCEO:25V Pd - Power Dissipation:300mW DC Current Gain:200@500mA,1V DC Current Gain:200@500mA,1V Transition frequency(fT):150MHz Current - Collector Cutoff:100nA Vce Saturation(VCE(sat)):60; LCSC Part Name: H档(200-350) NPN 电流:0.5A 电压:25V; Supplier Part: S8050_C2146.1; Manufacturer: CJ(江苏长电/长晶); Supplier Footprint: SOT-23; JLCPCB Part Class: Basic Part; Datasheet: https://item.szlcsc.com/datasheet/S8050%2520J3Y(RANGE%253A200-350)/2503.html; Supplier: LCSC; type: NPN; Current - Collector(Ic): 500mA; Collector - Emitter Voltage VCEO: 25V; Pd - Power Dissipation: 300mW; DC Current Gain: 200@500mA,1V; Transition frequency(fT): 150MHz; Current - Collector Cutoff: 100nA; Vce Saturation(VCE(sat)): 600mV@500mA,50mA; Operating Temperature: -55℃~+150℃; Emitter-Base Voltage(Vebo): 5V; Number: 1 NPN
R_CS_UP R_DRDY_UP R_EN_UP R_IO0_UP R_IO2_DN R_IO15_DN R_LED R_PWDN_UP R_Q_EN_B R_Q_IO0_B R_RST_UP R_START_DN = 0603WAF1002T5E: Type:Thick Film Resistor Resistance:10kΩ Tolerance:±1% Tolerance:±1% Power(Watts):100mW Voltage-Supply(Max):75V Temperature Coefficient:±100ppm/℃ Temperature Coefficient:±100ppm/℃ Operating Temperature:-55℃~+155℃ Operating Temperature:-55℃~+155℃; LCSC Part Name: 厚膜电阻 10kΩ ±1% 100mW; Supplier Part: 0603WAF1002T5E.1; Manufacturer: UNI-ROYAL(厚声); Supplier Footprint: 0603; JLCPCB Part Class: Basic Part; Datasheet: https://item.szlcsc.com/datasheet/0603WAF1002T5E/26547.html; Supplier: LCSC; Type: Thick Film Resistor; Tolerance: ±1%; Power(Watts): 100mW; Voltage-Supply(Max): 75V; Temperature Coefficient: ±100ppm/℃; Operating Temperature: -55℃~+155℃
U_MCU = ESP32-WROOM-32E-N4: Utilized IC / Part:ESP32-D0WDR2-V3；ESP32-D0WD-V3 Wireless Standard:Bluetooth4.2 Interface Type:I2C；GPIO；UART；SPI；SDIO Frequency:2.4GHz Antenna Type:On-board PCB Antenna Output Power:20dBm Output Power:20dBm Voltage - Supply:3V~3.6V Voltage - Supply:3V~3.6; LCSC Part Name: 不带固件 通用型Wi-Fi+BT+BLE MCU模组; Supplier Part: ESP32-WROOM-32E(4MB).1; Manufacturer: ESPRESSIF(乐鑫); Supplier Footprint: SMD,25.5x18mm; JLCPCB Part Class: Extended Part; Datasheet: https://item.szlcsc.com/datasheet/ESP32-WROOM-32E-N4/736349.html; Supplier: LCSC; Utilized IC / Part: ESP32-D0WDR2-V3；ESP32-D0WD-V3; Wireless Standard: Bluetooth4.2; Interface Type: I2C；GPIO；UART；SPI；SDIO; Antenna Type: On-board PCB Antenna; Output Power: 20dBm; Voltage - Supply: 3V~3.6V; Receive  Current: 112mA; Send  Current: 239mA; Sensitivity: -98dBm; Operating Temperature: -40℃~+85℃
U_USB = CH340C: Applications Function:Transceiver USB Protocol:USB 2.0 Voltage - Supply:3.3V；5V Voltage - Supply:3.3V；5V Data Rate:2Mbps Operating Temperature:-20℃~+70℃ Operating Temperature:-20℃~+70℃ Current - Supply:7mA Supply Current (Iq):50uA; LCSC Part Name: USB转串口芯片; Supplier Part: CH340C.1; Manufacturer: WCH(南京沁恒); Supplier Footprint: SOP-16; JLCPCB Part Class: Extended Part; Datasheet: https://item.szlcsc.com/datasheet/CH340C/85852.html; Supplier: LCSC; Applications Function: Transceiver; USB Protocol: USB 2.0; Voltage - Supply: 3.3V；5V; Data Rate: 2Mbps; Operating Temperature: -20℃~+70℃; Current - Supply: 7mA; Supply Current (Iq): 50uA
C_VCAP1_H C_VCAP3_H = CL05B104KO5NNNC: Capacitance:100nF Tolerance:±10% Tolerance:±10% Voltage Rating:16V Temperature Coefficient:X7R; LCSC Part Name: 100nF ±10% 16V; Supplier Part: C1525; Manufacturer: SAMSUNG(三星); Supplier Footprint: 0402; JLCPCB Part Class: Basic Part; Datasheet: https://item.szlcsc.com/datasheet/CL05B104KO5NNNC/1877.html; Supplier: LCSC; Tolerance: ±10%; Voltage Rating: 16V; Temperature Coefficient: X7R
C_VCAP2 C_VCAP3 = CL05A105KA5NQNC: Capacitance:1uF Tolerance:±10% Tolerance:±10% Voltage Rating:25V Temperature Coefficient:X5R; LCSC Part Name: 1uF ±10% 25V; Supplier Part: C52923; Manufacturer: SAMSUNG(三星); Supplier Footprint: 0402; JLCPCB Part Class: Basic Part; Datasheet: https://item.szlcsc.com/datasheet/CL05A105KA5NQNC/53938.html; Supplier: LCSC; Tolerance: ±10%; Voltage Rating: 25V; Temperature Coefficient: X5R
R_BIAS_FB R_BIAS_SER = 0805W8F1004T5E: Type:Thick Film Resistors Resistance:1MΩ Tolerance:±1% Tolerance:±1% Power(Watts): Overload Voltage (Max): Temperature Coefficient:±100ppm/℃ Temperature Coefficient:±100ppm/℃ Operating Temperature Range:-55℃~+155℃ Operating Temperature Range:-55℃~+155℃; LCSC Part Name: 1MΩ ±1% 125mW 厚膜电阻; Supplier Part: 0805W8F1004T5E.1; Manufacturer: UNI-ROYAL(厚声); Supplier Footprint: 0805; JLCPCB Part Class: Basic Part; Datasheet: https://atta.szlcsc.com/upload/public/pdf/source/20200306/C422600_1E6D84923E4A46A82E41ADD87F860B5C.pdf; Supplier: LCSC; Type: Thick Film Resistors; Tolerance: ±1%; Temperature Coefficient: ±100ppm/℃; Operating Temperature Range: -55℃~+155℃
R_MISO R_MOSI R_SCLK R_SRB_SER = 0805W8F0000T5E_C17477: Type:Thick Film Resistor Resistance:0Ω Tolerance:±1% Tolerance:±1% Power(Watts):125mW Voltage-Supply(Max):150V Temperature Coefficient:±800ppm/℃ Temperature Coefficient:±800ppm/℃ Operating Temperature:-55℃~+155℃ Operating Temperature:-55℃~+155℃; LCSC Part Name: 0Ω ±1% 125mW 厚膜电阻; Supplier Part: 0805W8F0000T5E.1; Manufacturer: UNI-ROYAL(厚声); Manufacturer Part: 0805W8F0000T5E; Supplier Footprint: 0805; JLCPCB Part Class: Basic Part; Datasheet: https://item.szlcsc.com/datasheet/0805W8F0000T5E/18165.html; Supplier: LCSC; Type: Thick Film Resistor; Tolerance: ±1%; Power(Watts): 125mW; Voltage-Supply(Max): 150V; Temperature Coefficient: ±800ppm/℃; Operating Temperature: -55℃~+155℃
U_ADS = ADS1299IPAGR: Resolution(Bits):24 Gain Drift:3ppm/℃ Voltage - Supply:4.75V~5.25V Voltage - Supply:4.75V~5.25V S/N Ratio:121dB Operating Temperature:-40℃~+85℃ Operating Temperature:-40℃~+85℃ Data rate:16000Hz Clock Frequency:2.048MHz；1.5MHz~2.048MHz Clock Frequency:2.04; LCSC Part Name: ADS1299-x 低噪声、4/6/8通道、24bit 、同时采样模数转换器，用于EEG和生物电bit 测量; Supplier Part: ADS1299IPAGR.1; Manufacturer: TI(德州仪器); Supplier Footprint: TQFP-64(10x10); JLCPCB Part Class: Extended Part; Datasheet: https://www.ti.com/cn/lit/gpn/ads1299; Supplier: LCSC; Resolution(Bits): 24; Gain Drift: 3ppm/℃; Voltage - Supply: 4.75V~5.25V; S/N Ratio: 121dB; Operating Temperature: -40℃~+85℃; Data rate: 16000Hz; Clock Frequency: 2.048MHz；1.5MHz~2.048MHz; Sampling Rate: 16000Hz; Voltage Reference Value: 4.5V; Voltage Reference Drift: 35ppm/℃; Quiescent Current (Iq): 20uA; Interface: SPI
C_CM1N C_CM1P C_CM2N C_CM2P C_CM3N C_CM3P C_CM4N C_CM4P C_CM5N C_CM5P C_CM6N C_CM6P C_CM7N C_CM7P C_CM8N C_CM8P = CL10B102KB8NNNC: Capacitance:1nF Tolerance:±10% Tolerance:±10% Voltage Rating:50V Temperature Coefficient:X7R; LCSC Part Name: 1nF ±10% 50V; Supplier Part: CL10B102KB8NNNC.1; Manufacturer: SAMSUNG(三星); Supplier Footprint: 0603; JLCPCB Part Class: Basic Part; Datasheet: https://item.szlcsc.com/datasheet/CL10B102KB8NNNC/1940.html; Supplier: LCSC; Tolerance: ±10%; Voltage Rating: 50V; Temperature Coefficient: X7R
C_DIF1-C_DIF8 = CL21F104ZBCNNNC: Capacitance:100nF Tolerance:-20%~+80% Tolerance:-20%~+80% Voltage Rating:50V Temperature Coefficient:Y5V; LCSC Part Name: 100nF -20%~+80% 50V; Supplier Part: CL21F104ZBCNNNC.1; Manufacturer: SAMSUNG(三星); Supplier Footprint: 0805; JLCPCB Part Class: Extended Part; Datasheet: https://item.szlcsc.com/datasheet/CL21F104ZBCNNNC/2112.html; Supplier: LCSC; Tolerance: -20%~+80%; Voltage Rating: 50V; Temperature Coefficient: Y5V
J2 = PZ254V-11-12P: Pin Structure:1x12P Pitch:2.54mm Row Spacing:- Circluar Pins/Square Pins:Pin Header Mounting Type:Through Hole Number of Rows:1 Number of Pins:12P Current Rating:3A Voltage Rating (Max):250V Length of Mating Pin:6mm Insulation Height:2.5mm Length of End C; LCSC Part Name: 1x12P 间距:2.54mm 方针 直插; Supplier Part: PZ254V-11-12P.1; Manufacturer: XFCN(兴飞); Supplier Footprint: 插件,P=2.54mm; JLCPCB Part Class: Extended Part; Datasheet: https://item.szlcsc.com/datasheet/PZ254V-11-12P/3017606.html; Supplier: LCSC; Pin Structure: 1x12P; Pitch: 2.54mm; Circluar Pins/Square Pins: Pin Header; Mounting Type: Through Hole; Number of Rows: 1; Number of Pins: 12P; Current Rating: 3A; Voltage Rating (Max): 250V; Length of Mating Pin: 6mm; Insulation Height: 2.5mm; Length of End Connection Pin: 3mm; Operating Temperature: -40℃~+105℃; Color: Black
R_IN1N R_IN1P R_IN2N R_IN2P R_IN3N R_IN3P R_IN4N R_IN4P R_IN5N R_IN5P R_IN6N R_IN6P R_IN7N R_IN7P R_IN8N R_IN8P = 0402WGF1002TCE: Type:Thick Film Resistor Resistance:10kΩ Tolerance:±1% Tolerance:±1% Power(Watts):62.5mW Voltage-Supply(Max):50V Temperature Coefficient:±100ppm/℃ Temperature Coefficient:±100ppm/℃ Operating Temperature:-55℃~+155℃ Operating Temperature:-55℃~+155℃; LCSC Part Name: 10kΩ ±1% 62.5mW 厚膜电阻; Supplier Part: 0402WGF1002TCE.1; Manufacturer: UNI-ROYAL(厚声); Supplier Footprint: 0402; JLCPCB Part Class: Basic Part; Datasheet: https://item.szlcsc.com/datasheet/0402WGF1002TCE/26487.html; Supplier: LCSC; Type: Thick Film Resistor; Tolerance: ±1%; Power(Watts): 62.5mW; Voltage-Supply(Max): 50V; Temperature Coefficient: ±100ppm/℃; Operating Temperature: -55℃~+155℃

## Nets
AVDD: C_AVDD1_1u.1 C_AVDD1_10n.1 C_AVDD1_10u.1 C_AVDD1_100n.1 C_AVDD_B.1 C_AVDD_H.1 C_AVDD_P3.1 C_AVDD_P19.1 C_AVDD_P31.1 C_AVDD_P36.1 C_AVDD_P59.1 C_AVDD_P64.1 C_PLDO_OUT.2 TLV70025.5(OUT) U_ADS.19(AVDD) U_ADS.21(AVDD) U_ADS.22(AVDD) U_ADS.54(AVDD1) U_ADS.56(AVDD) U_ADS.59(AVDD)
AVSS: C_AVDD1_1u.2 C_AVDD1_10n.2 C_AVDD1_10u.2 C_AVDD1_100n.2 C_AVSS_B.1 C_AVSS_H.1 C_AVSS_P17.1 C_AVSS_P30.1 C_AVSS_P37.1 C_AVSS_P60.1 C_NLDO_OUT.2 C_VCAP1.2 C_VCAP1_H.2 C_VCAP2.2 C_VCAP3.2 C_VCAP3_H.2 C_VCAP4.2 C_VREFP_10n.2 C_VREFP_10u.2 C_VREFP_100n.2 TPS72325.5(OUT) U_ADS.20(AVSS) U_ADS.23(AVSS) U_ADS.25(VREFN) U_ADS.32(AVSS) U_ADS.53(AVSS1) U_ADS.57(AVSS) U_ADS.58(AVSS)
DVDD: C_DVDD_10u.1 C_DVDD_B.1 C_DVDD_H.1 C_DVDD_P40.1 C_DVDD_P58.1 FB5.2 R_CS_UP.2 R_DRDY_UP.2 R_PWDN_UP.2 R_RST_UP.2 U_ADS.48(DVDD) U_ADS.50(DVDD) U_ADS.52(CLKSEL)
GND: AMS1117.1(GND) C_3V3_B.2 C_3V3_B2.2 C_3V3_H.2 C_3V3_H2.2 C_3V3_IN.2 C_3V3_M.2 C_3V3_OUT.2 C_AVDD_B.2 C_AVDD_H.2 C_AVDD_P3.2 C_AVDD_P19.2 C_AVDD_P31.2 C_AVDD_P36.2 C_AVDD_P59.2 C_AVDD_P64.2 C_AVSS_B.2 C_AVSS_H.2 C_AVSS_P17.2 C_AVSS_P30.2 C_AVSS_P37.2 C_AVSS_P60.2 C_BIAS_INV.2 C_BULK.2 C_CM1N.2 C_CM1P.2 C_CM2N.2 C_CM2P.2 C_CM3N.2 C_CM3P.2 C_CM4N.2 C_CM4P.2 C_CM5N.2 C_CM5P.2 C_CM6N.2 C_CM6P.2 C_CM7N.2 C_CM7P.2 C_CM8N.2 C_CM8P.2 C_DVDD_10u.2 C_DVDD_B.2 C_DVDD_H.2 C_DVDD_P40.2 C_DVDD_P58.2 C_EN_DLY.2 C_HF.2 C_LM_IN.2 C_LM_OUT.2 C_NLDO_IN.2 C_NLDO_OUT.1 C_NR.2 C_PLDO_IN.2 C_PLDO_OUT.1 C_RST_DLY.2 C_USB5V_B.2 C_USB5V_H.2 C_USB_V3.2 C_USB_VCC.2 D_ESD.2 D_LED.1(C) J1.1(GND) J1.12(GND) LM2664.1(GND) R_CC1.2 R_CC2.2 R_IO2_DN.2 R_IO15_DN.2 R_START_DN.2 TLV70025.2(GND) TPS72325.1(GND) U_ADS.31(RESV1) U_ADS.33(DGND) U_ADS.41(DAISY_IN) U_ADS.42(GPIO1) U_ADS.44(GPIO2) U_ADS.45(GPIO3) U_ADS.46(GPIO4) U_ADS.49(DGND) U_ADS.51(DGND) U_MCU.1(GND) U_MCU.15(GND) U_MCU.38(GND) U_MCU.39(GND) U_USB.1(GND) U_USB.15(R232)
V5_LM_IN: C_LM_IN.1 FB1.2 LM2664.4(SD) LM2664.5(V+)
VDD_ESP: AMS1117.2(VOUT) AMS1117.4(VOUT) C_3V3_B.1 C_3V3_B2.1 C_3V3_H.1 C_3V3_H2.1 C_3V3_M.1 C_3V3_OUT.1 FB5.1 R_EN_UP.1 R_IO0_UP.1 U_MCU.2(3V3)
A1_ELEC: J2.11 R_BIAS_SER.2
A2_ELEC: J2.10 R_SRB_SER.2
ADS_CS_N: R_CS_UP.1 U_ADS.39(CS#) U_MCU.29(IO5)
ADS_DIN_LOC: R_MOSI.1 U_ADS.34(DIN)
ADS_DOUT_LOC: R_MISO.1 U_ADS.43(DOUT)
ADS_DRDY_N: R_DRDY_UP.1 U_ADS.47(DRDY#) U_MCU.12(IO27)
ADS_PWDN_N: R_PWDN_UP.1 U_ADS.35(PWDN#) U_MCU.16(IO13)
ADS_RESET_N: C_RST_DLY.1 R_RST_UP.1 U_ADS.36(RESET#) U_MCU.14(IO12)
ADS_SCLK_LOC: R_SCLK.1 U_ADS.40(SCLK)
ADS_START: R_START_DN.1 U_ADS.38(START) U_MCU.13(IO14)
BIAS_INV: C_BIAS_INV.1 R_BIAS_FB.1 U_ADS.61(BIASINV)
BIAS_OUT_INT: R_BIAS_FB.2 R_BIAS_SER.1 U_ADS.63(BIASOUT)
CH3_ELEC: J2.3 R_IN3P.1
CH5_ELEC: J2.6 R_IN5P.1
CH6_ELEC: J2.7 R_IN6P.1
CH7_ELEC: J2.8 R_IN7P.1
CH8_ELEC: J2.9 R_IN8P.1
CH340_V3: C_USB_V3.1 U_USB.4(V3)
CH_DTR_N: Q_IO0.2(E) R_Q_EN_B.1 U_USB.13(DTR#)
CH_RTS_N: Q_EN.2(E) R_Q_IO0_B.1 U_USB.14(RTS#)
CHASSIS_GND: J1.13(SHELL) J1.14(SHELL) J2.12
ECGN_ELEC: J2.5 R_IN4N.1
ECGP_ELEC: J2.4 R_IN4P.1
ESP_EN: C_EN_DLY.1 Q_EN.3(C) R_EN_UP.2 U_MCU.3(EN)
ESP_IO0: Q_IO0.3(C) R_IO0_UP.2 U_MCU.25(IO0)
ESP_IO2: R_IO2_DN.1 U_MCU.24(IO2)
ESP_IO15: R_IO15_DN.1 U_MCU.23(IO15)
ESP_RXD: U_MCU.34(RXD0) U_USB.2(TXD)
ESP_TXD: U_MCU.35(TXD0) U_USB.3(RXD)
FP1_ELEC: J2.1 R_IN1P.1
FP2_ELEC: J2.2 R_IN2P.1
IN1N: C_CM1N.1 C_DIF1.2 R_IN1N.2 U_ADS.15(IN1N)
IN1P: C_CM1P.1 C_DIF1.1 R_IN1P.2 U_ADS.16(IN1P)
IN2N: C_CM2N.1 C_DIF2.2 R_IN2N.2 U_ADS.13(IN2N)
IN2P: C_CM2P.1 C_DIF2.1 R_IN2P.2 U_ADS.14(IN2P)
IN3N: C_CM3N.1 C_DIF3.2 R_IN3N.2 U_ADS.11(IN3N)
IN3P: C_CM3P.1 C_DIF3.1 R_IN3P.2 U_ADS.12(IN3P)
IN4N: C_CM4N.1 C_DIF4.2 R_IN4N.2 U_ADS.9(IN4N)
IN4P: C_CM4P.1 C_DIF4.1 R_IN4P.2 U_ADS.10(IN4P)
IN5N: C_CM5N.1 C_DIF5.2 R_IN5N.2 U_ADS.7(IN5N)
IN5P: C_CM5P.1 C_DIF5.1 R_IN5P.2 U_ADS.8(IN5P)
IN6N: C_CM6N.1 C_DIF6.2 R_IN6N.2 U_ADS.5(IN6N)
IN6P: C_CM6P.1 C_DIF6.1 R_IN6P.2 U_ADS.6(IN6P)
IN7N: C_CM7N.1 C_DIF7.2 R_IN7N.2 U_ADS.3(IN7N)
IN7P: C_CM7P.1 C_DIF7.1 R_IN7P.2 U_ADS.4(IN7P)
IN8N: C_CM8N.1 C_DIF8.2 R_IN8N.2 U_ADS.1(IN8N)
IN8P: C_CM8P.1 C_DIF8.1 R_IN8P.2 U_ADS.2(IN8P)
LED_A: D_LED.2(A) R_LED.2
LM_CAP_N: C_LM_FLY.2 LM2664.3(C1-)
LM_CAP_P: C_LM_FLY.1 LM2664.6(C1+)
Q_EN_B: Q_EN.1(B) R_Q_EN_B.2
Q_IO0_B: Q_IO0.1(B) R_Q_IO0_B.2
SPI_MISO: R_MISO.2 U_MCU.31(IO19)
SPI_MOSI: R_MOSI.2 U_MCU.37(IO23)
SPI_SCK: R_SCLK.2 U_MCU.30(IO18)
SRB1: R_IN1N.1 R_IN2N.1 R_IN3N.1 R_IN5N.1 R_IN6N.1 R_IN7N.1 R_IN8N.1 R_SRB_SER.1 U_ADS.17(SRB1) U_ADS.18(SRB2)
STATUS_LED_DRV: R_LED.1 U_MCU.28(IO17)
TPS_NR: C_NR.1 TPS72325.4(NR/FB)
USB_5V: C_BULK.1 C_HF.1 C_USB5V_B.1 C_USB5V_H.1 C_USB_VCC.1 F1.2 FB1.1 FB2.1 FB3.1 U_USB.16(VCC)
USB_CC1: J1.4(CC1) R_CC1.1
USB_CC2: J1.10(CC2) R_CC2.1
USB_DM: D_ESD.3 D_ESD.4 J1.5(DN2) J1.7(DN1) U_USB.6(D-)
USB_DP: D_ESD.1 D_ESD.6 J1.6(DP1) J1.8(DP2) U_USB.5(D+)
USB_VBUS_RAW: D_ESD.5 F1.1 J1.2(VBUS) J1.11(VBUS)
V_3V3_IN: AMS1117.3(VIN) C_3V3_IN.1 FB3.2
V_NLDO_IN: C_NLDO_IN.1 FB4.2 TPS72325.2(IN) TPS72325.3(EN)
V_PLDO_IN: C_PLDO_IN.1 FB2.2 TLV70025.1(IN) TLV70025.3(EN)
VCAP1: C_VCAP1.1 C_VCAP1_H.1 U_ADS.28(VCAP1)
VCAP2: C_VCAP2.1 U_ADS.30(VCAP2)
VCAP3: C_VCAP3.1 C_VCAP3_H.1 U_ADS.55(VCAP3)
VCAP4: C_VCAP4.1 U_ADS.26(VCAP4)
VNEG5: C_LM_OUT.1 FB4.1 LM2664.2(OUT)
VREFP: C_VREFP_10n.1 C_VREFP_10u.1 C_VREFP_100n.1 U_ADS.24(VREFP)

Not connected (* = marked no-connect by the designer): J1 3(SBU2) 9(SBU1); TLV70025 4(NC); U_ADS 27(NC) 29(NC) 37(CLK) 60(BIASREF) 62(BIASIN) 64(RESERVED); U_MCU 4(SENSOR_VP) 5(SENSOR_VN) 6(IO34) 7(IO35) 8(IO32) 9(IO33) 10(IO25) 11(IO26) 17(NC) 18(NC) 19(NC) 20(NC) 21(NC) 22(NC) 26(IO4) 27(IO16) 32(NC) 33(IO21) 36(IO22); U_USB 7(NC.) 8(OUT#) 9(CTS#) 10(DSR#) 11(RI#) 12(DCD#)
